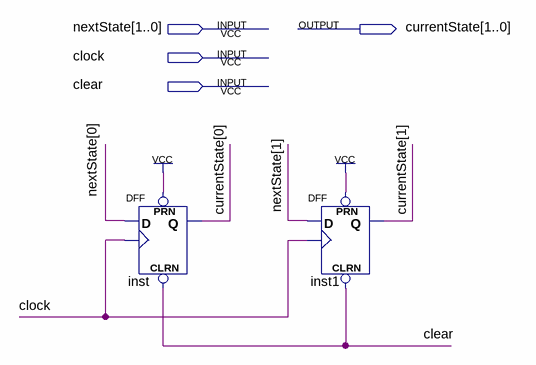
[diagram p0: schematic sheet]
// Quartus schematic StateRegister.bdf as structural Verilog: 2 symbols, 4 pins
module StateRegister (
  input  [1:0] nextState,
  input  clock,
  input  clear,
  output [1:0] currentState
);

  DFF inst (.CLRN(clear), .CLK(clock), .D(nextState[0]), .PRN(1'b1), .Q(currentState[0]));
  DFF inst1 (.CLRN(clear), .CLK(clock), .D(nextState[1]), .PRN(1'b1), .Q(currentState[1]));
endmodule
